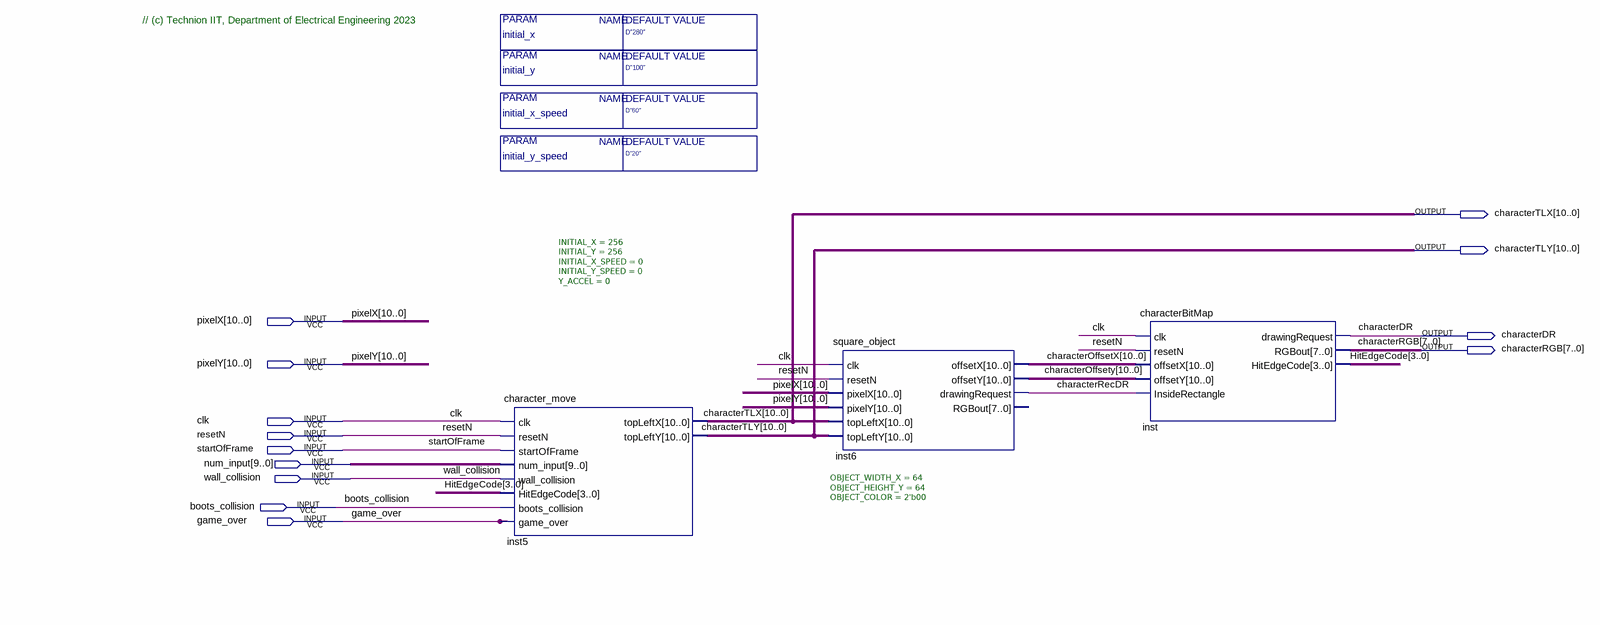
[diagram p0: schematic sheet]
// Quartus schematic Character_Block_T.bdf as structural Verilog: 3 symbols, 13 pins
module Character_Block_T #(parameter initial_x = "D\"280\"", parameter initial_x_speed = "D\"60\"", parameter initial_y_speed = "D\"20\"", parameter initial_y = "D\"100\"") (
  input  [10:0] pixelX,
  input  [10:0] pixelY,
  input  clk,
  input  resetN,
  input  startOfFrame,
  input  [9:0] num_input,
  input  wall_collision,
  input  boots_collision,
  input  game_over,
  output [10:0] characterTLX,
  output [10:0] characterTLY,
  output characterDR,
  output [7:0] characterRGB
);

  wire characterRecDR;
  wire [3:0] HitEdgeCode;
  wire [10:0] characterOffsetX, characterOffsety;

  character_move #(.INITIAL_X(256), .INITIAL_Y(256), .INITIAL_X_SPEED(0), .INITIAL_Y_SPEED(0), .Y_ACCEL(0)) inst5 (
    .clk(clk), .resetN(resetN), .startOfFrame(startOfFrame), .num_input(num_input),
    .wall_collision(wall_collision), .HitEdgeCode(HitEdgeCode), .boots_collision(boots_collision),
    .game_over(game_over), .topLeftX(characterTLX), .topLeftY(characterTLY));
  square_object #(.OBJECT_WIDTH_X(64), .OBJECT_HEIGHT_Y(64), .OBJECT_COLOR(2'b00)) inst6 (
    .clk(clk), .resetN(resetN), .pixelX(pixelX), .pixelY(pixelY), .topLeftX(characterTLX),
    .topLeftY(characterTLY), .offsetX(characterOffsetX), .offsetY(characterOffsety),
    .drawingRequest(characterRecDR));  // open: RGBout
  characterBitMap inst (
    .clk(clk), .resetN(resetN), .offsetX(characterOffsetX), .offsetY(characterOffsety),
    .InsideRectangle(characterRecDR), .drawingRequest(characterDR), .RGBout(characterRGB),
    .HitEdgeCode(HitEdgeCode));

  // Notes on the sheet:
  //   // (c) Technion IIT, Department of Electrical Engineering 2023
endmodule
